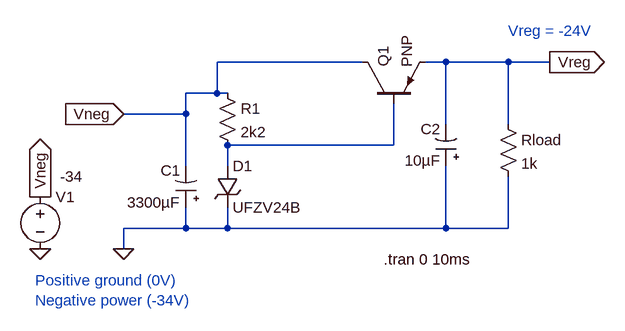
[diagram p0: schematic calculator-power-24v.asc]
calculator-power-24v.asc, the LTspice schematic file:
Version 4
SHEET 1 916 680
WIRE 528 64 304 64
WIRE 656 64 624 64
WIRE 752 64 656 64
WIRE 816 64 752 64
WIRE 304 112 304 64
WIRE 304 112 256 112
WIRE 320 112 304 112
WIRE 256 144 256 112
WIRE 256 144 160 144
WIRE 656 160 656 64
WIRE 752 160 752 64
WIRE 576 192 576 128
WIRE 576 192 320 192
WIRE 256 224 256 144
WIRE 320 224 320 192
WIRE 256 320 256 288
WIRE 256 320 160 320
WIRE 320 320 320 288
WIRE 320 320 256 320
WIRE 656 320 656 224
WIRE 656 320 320 320
WIRE 752 320 752 240
WIRE 752 320 656 320
WIRE 160 352 160 320
FLAG 32 352 0
FLAG 32 272 Vneg
IOPIN 32 272 Out
FLAG 160 352 0
FLAG 160 144 Vneg
IOPIN 160 144 In
FLAG 816 64 Vreg
IOPIN 816 64 Out
SYMBOL Voltage 32 256 R0
WINDOW 3 31 -16 Left 2
SYMATTR Value -34
SYMATTR InstName V1
SYMBOL polcap 272 288 R180
WINDOW 0 24 57 Left 2
WINDOW 3 24 8 Left 2
SYMATTR InstName C1
SYMATTR Value 3300µF
SYMBOL zener 304 224 R0
SYMATTR InstName D1
SYMATTR Value UFZV24B
SYMBOL Res 304 96 R0
SYMATTR InstName R1
SYMATTR Value 2k2
SYMBOL pnp 528 128 R270
SYMATTR InstName Q1
SYMBOL Res 736 144 R0
SYMATTR InstName Rload
SYMATTR Value 1k
SYMBOL polcap 672 224 R180
WINDOW 0 24 57 Left 2
WINDOW 3 24 8 Left 2
SYMATTR InstName C2
SYMATTR Value 10µF
TEXT 24 400 Left 2 ;Positive ground (0V)\nNegative power (-34V)
TEXT 560 368 Left 2 !.tran 0 10ms
TEXT 752 16 Left 2 ;Vreg = -24V

The netlist it stands for:
* calculator-power-24v.asc
V1 Vneg 0 -34
C1 0 Vneg 3300µF
D1 N001 0 UFZV24B
R1 Vneg N001 2k2
Q1 Vneg N001 Vreg 0 PNP
Rload Vreg 0 1k
C2 0 Vreg 10µF
.model D D
.lib standard.dio
.model NPN NPN
.model PNP PNP
.lib standard.bjt
* Positive ground (0V)
* Negative power (-34V)
.tran 0 10ms
* Vreg = -24V
.backanno
.end